# Altium schematic sheet Power_4.schdoc: TEBF0808 - Power
size A4; DocumentNumber: TEBF0808; Revision: 04; SheetNumber: 34; SheetTotal: 36; Date: 2016-09-29; CompanyName: Trenz Electronic GmbH; Organization: Trenz Electronic GmbH
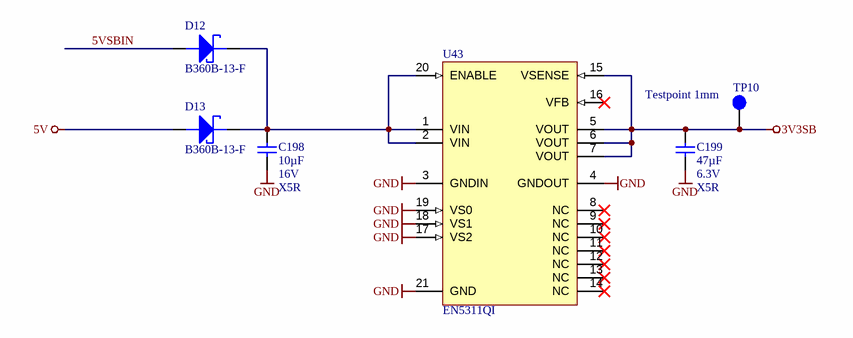
[diagram p0: Power_4.schdoc]

## Parts
C198  10µF  Voltage: 16V  Technology: X5R  [CAPC1608X90N]
C199  47µF  Voltage: 6.3V  Technology: X5R  [CAPC3216X180N]
D12  B360B-13-F  [DIOM4336X250N]
D13  B360B-13-F  [DIOM4336X250N]
TP10  Testpoint 1mm  [TP_1mm]
U43  EN5311QI  [EN5311QI]

## Nets
3V3SB: C199.1 TP10.1 U43.5(VOUT) U43.6(VOUT) U43.7(VOUT) U43.15(VSENSE)
5V: D13.2(ANODE)
GND: C198.2 C199.2 U43.3(GNDIN) U43.4(GNDOUT) U43.17(VS2) U43.18(VS1) U43.19(VS0) U43.21(GND)
5VSBIN: D12.2(ANODE)
NetC198_1: C198.1 D12.1(KATHODE) D13.1(KATHODE) U43.1(VIN) U43.2(VIN) U43.20(ENABLE)

Not connected (* = marked no-connect by the designer): U43 8(NC)* 9(NC)* 10(NC)* 11(NC)* 12(NC)* 13(NC)* 14(NC)* 16(VFB)*

## Notes on the sheet
- Title:
- Number:
- Rev.
- Date:
- A4
- Copyright:
- Page
- of
- Filename:

## Library data of the parts
C198 = 25341: KON 10µF 16V X5R SMD 20%; AN: 25341; Mixed: SMT; Value: 10u; Preferred: Yes; Case: 1608 (0603); Tolerance: 20%
C199 = 24557: KON 47µF 6.3V  X5R SMD 20%; AN: 24557; Value: 47u; Mixed: SMT; Preferred: Yes; Case: 3216 (1206); Tolerance: 20%
D12 D13 = 24916: B360B-13-F SMD; AN: 24916; Mixed: SMT; Case: SMB; HelpURL: B:\AD\adlib\datasheet\B3x0B; H-ART: B360B-13-F
TP10 = 25063: AN: 25063; Mixed: SMT
U43 = 25492: AN: 25492; Mixed: SMT; Trenz-Stock: Yes; Case: QFN20; HelpURL: B:\AD\adlib\datasheet\EN5311QI; Preferred: Yes; H-ART: EN5311QI